# Altium schematic sheet SMPS.SchDoc: Buck Sinc Converter
size A4; Organization: UDESC; Revision: R0; SheetNumber: 7; SheetTotal: 10
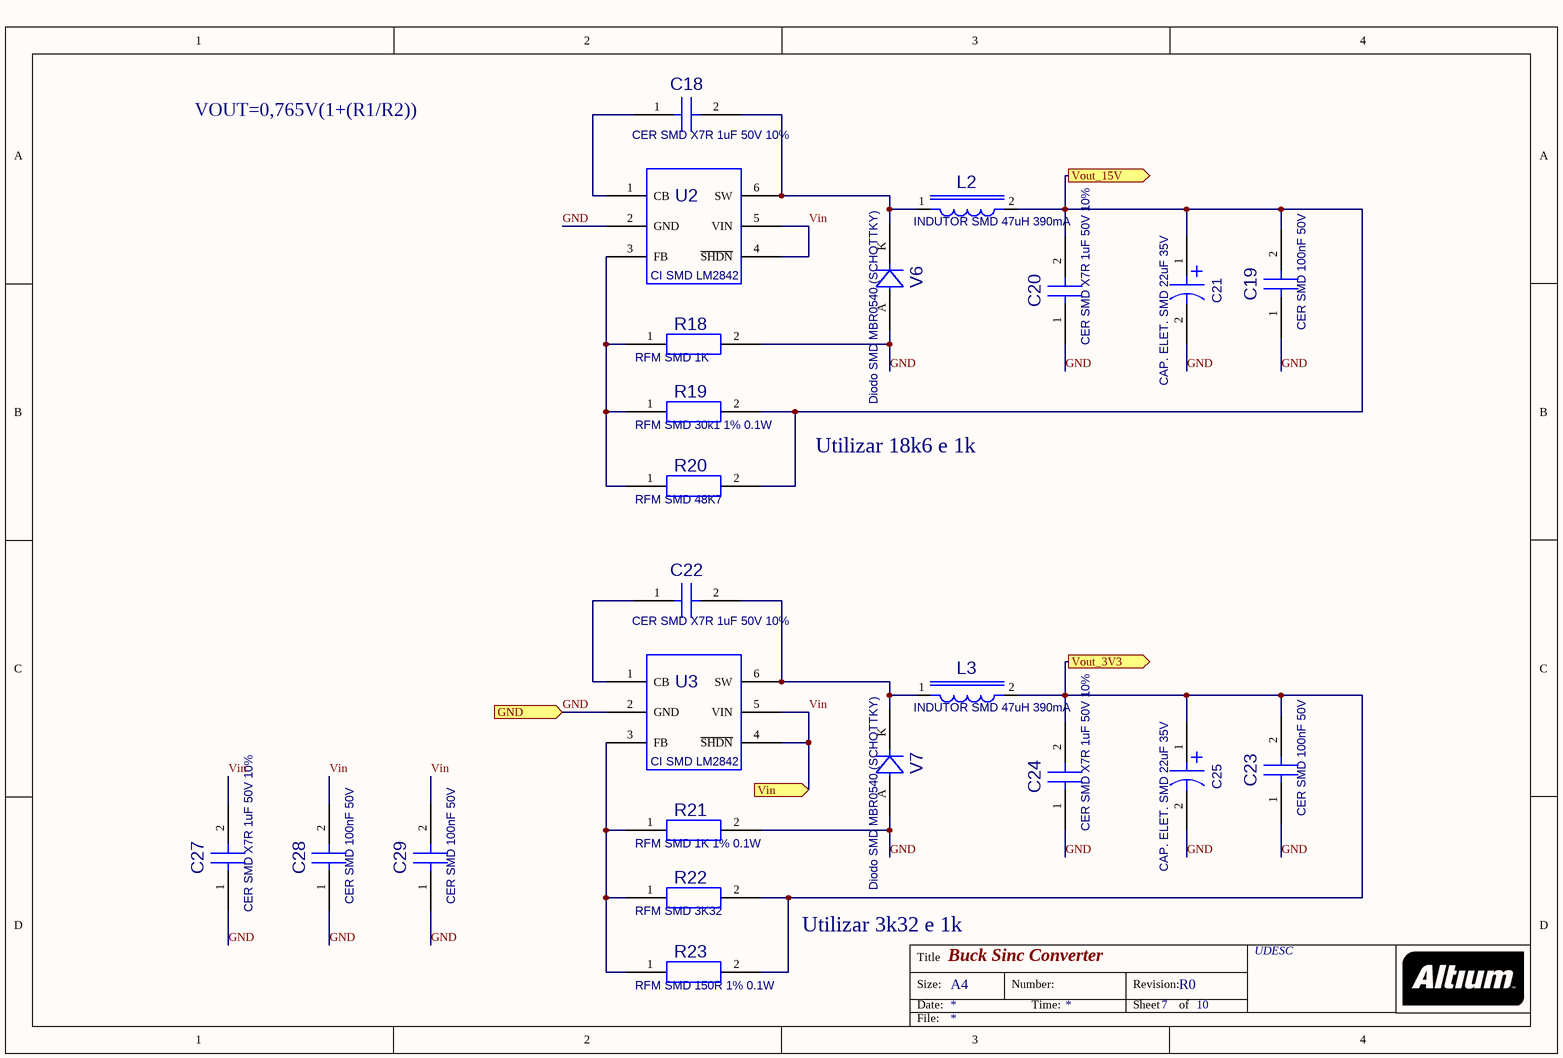
[diagram p0: SMPS.SchDoc]

## Parts
C18  value CER SMD X7R 1uF 50V 10%  [C0805_R_V0]  (hidden comment: 11736520)
C19  value CER SMD 100nF 50V  [C0805_R_V0]  (hidden comment: 10192075)
C20  value CER SMD X7R 1uF 50V 10%  [C0805_R_V0]  (hidden comment: 11736520)
C21  value CAP. ELET. SMD 22uF 35V  [CAP UUD CR 5X5.8]  (hidden comment: 11690909)
C22  value CER SMD X7R 1uF 50V 10%  [C0805_R_V0]  (hidden comment: 11736520)
C23  value CER SMD 100nF 50V  [C0805_R_V0]  (hidden comment: 10192075)
C24  value CER SMD X7R 1uF 50V 10%  [C0805_R_V0]  (hidden comment: 11736520)
C25  value CAP. ELET. SMD 22uF 35V  [CAP UUD CR 5X5.8]  (hidden comment: 11690909)
C27  value CER SMD X7R 1uF 50V 10%  [C0805_R_V0]  (hidden comment: 11736520)
C28  value CER SMD 100nF 50V  [C0805_R_V0]  (hidden comment: 10192075)
C29  value CER SMD 100nF 50V  [C0805_R_V0]  (hidden comment: 10192075)
L2  value INDUTOR SMD 47uH 390mA  [L1210]  (hidden comment: 12924787)
L3  value INDUTOR SMD 47uH 390mA  [L1210]  (hidden comment: 12924787)
R18  value RFM SMD 1K  [R0805_R_V0]  (hidden comment: 10118077)
R19  value RFM SMD 30k1 1% 0.1W  [R0805_R_V0]  (hidden comment: 10191986)
R20  value RFM SMD 48K7  [R0805_R_V0]  (hidden comment: 10192020)
R21  value RFM SMD 1K 1% 0.1W  [R0805_R_V0]  (hidden comment: 10118077)
R22  value RFM SMD 3K32  [R0805_R_V0]  (hidden comment: 10191979)
R23  value RFM SMD 150R 1% 0.1W  [R0805_R_V0]  (hidden comment: 10191981)
U2  value CI SMD LM2842  [SOT23-6]  (hidden comment: 12576507)
U3  value CI SMD LM2842  [SOT23-6]  (hidden comment: 12576507)
V6  value Diodo SMD MBR0540 (SCHOTTKY)  [SOD123A]  (hidden comment: 10192125)
V7  value Diodo SMD MBR0540 (SCHOTTKY)  [SOD123A]  (hidden comment: 10192125)

## Ports
GND (in), Vin (in), Vout_3V3 (out), Vout_15V (out)

## Nets
GND: C19.1 C20.1 C21.2 C23.1 C24.1 C25.2 C27.1 C28.1 C29.1 R18.2 R21.2 U2.2(GND) U3.2(GND) V6.A V7.A ; port GND
Vin: C27.2 C28.2 C29.2 U2.4(~{SHDN}) U2.5(VIN) U3.4(~{SHDN}) U3.5(VIN) ; port Vin
Vout_3V3: C23.2 C24.2 C25.1 L3.2 R22.2 R23.2 ; port Vout_3V3
Vout_15V: C19.2 C20.2 C21.1 L2.2 R19.2 R20.2 ; port Vout_15V
NetC18_1: C18.1 U2.1(CB)
NetC18_2: C18.2 L2.1 U2.6(SW) V6.K
NetC22_1: C22.1 U3.1(CB)
NetC22_2: C22.2 L3.1 U3.6(SW) V7.K
NetR18_1: R18.1 R19.1 R20.1 U2.3(FB)
NetR21_1: R21.1 R22.1 R23.1 U3.3(FB)

## Notes on the sheet
- VOUT=0,765V(1+(R1/R2))
- Utilizar 18k6 e 1k
- Utilizar 3k32 e 1k
- Title
- Size:
- Date:
- A4
- Number:
- Time:
- Revision:
- Sheet
- of
- File:

## Library data of the parts
C18 C20 C22 C24 C27 = 11736520: CER SMD X7R 1uF 50V 10%; HISsym: Atualizado em 12/07/05; HISitem: Criado em 15/04/11 (p/ Sandro W.); PN: 11736520; PMT: SMD
C19 C23 C28 C29 = 10192075: CER SMD 100nF 50V; HISsym: Atualizado em 12/07/05; TOL: 10%; ITEM BAAN: 0333.0044; PN: 10192075; PMT: SMD
C21 C25 = 11690909: CAP. ELET. SMD 22uF 35V; HISsym: Atualizado em 20/12/05; TOL: 20%; HISitem: Criado em 02/03/11 (p/ Osnir); Altura: 5,8mm; PN: 11690909; PMT: SMD; ComponenteLink1URL: *
L2 L3 = 12924787: INDUTOR SMD 47uH 390mA; HISsym: Atualizado em 09/08/05; HISitem: Criado em 05//03/13 (p/ Itamar); Altura: 4,8mm; PN: 12924787; PMT: SMD
R18 = 10191981: RFM SMD 1K; HISsym: Atualizado em 20/07/05; PN: 10118077; PMT: SMD
R19 = 10191981: RFM SMD 30k1 1% 0.1W; HISsym: Atualizado em 20/07/05; PN: 10191986; PMT: SMD
R20 = 10191981: RFM SMD 48K7; HISsym: Atualizado em 20/07/05; PN: 10192020; PMT: SMD
R21 = 10191981: RFM SMD 1K 1% 0.1W; HISsym: Atualizado em 20/07/05; PN: 10118077; PMT: SMD
R22 = 10191981: RFM SMD 3K32; HISsym: Atualizado em 20/07/05; PN: 10191979; PMT: SMD
R23 = 10191981: RFM SMD 150R 1% 0.1W; HISsym: Atualizado em 20/07/05; PN: 10191981; PMT: SMD
U2 U3 = 12576507: CI SMD LM2842; HISitem: Criado em 18/09/13 (p/ Afonso); PN: 12576507; PMT: SMD
V6 V7 = 10192125: Diodo SMD MBR0540 (SCHOTTKY); HISsym: Atualizado em 17/04/06; NUMBER PIN: 02; ITEM BAAN: 0334.0219; PN: 10192125; PMT: SMD